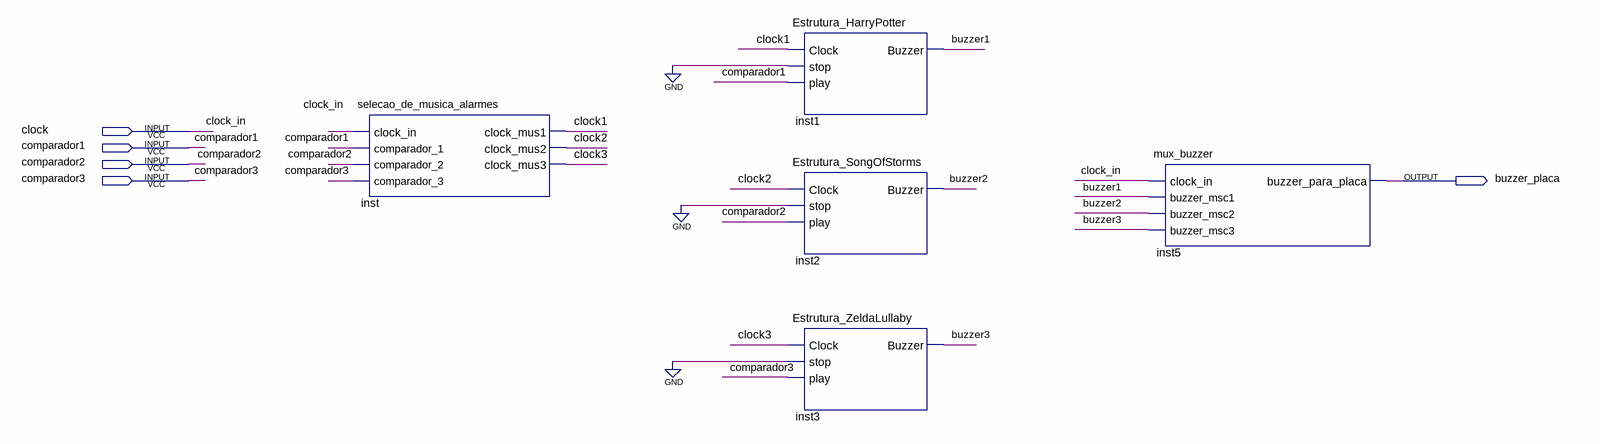
[diagram p0: schematic sheet]
// Quartus schematic Bloco_de_musicas.bdf as structural Verilog: 5 symbols, 5 pins
module Bloco_de_musicas (
  input  clock,
  input  comparador1,
  input  comparador2,
  input  comparador3,
  output buzzer_placa
);

  wire buzzer1, buzzer2, buzzer3, clock1, clock2, clock3;

  selecao_de_musica_alarmes inst (
    .clock_in(clock), .comparador_1(comparador1), .comparador_2(comparador2), .comparador_3(comparador3),
    .clock_mus1(clock1), .clock_mus2(clock2), .clock_mus3(clock3));
  Estrutura_HarryPotter inst1 (.Clock(clock1), .stop(1'b0), .play(comparador1), .Buzzer(buzzer1));
  Estrutura_SongOfStorms inst2 (.Clock(clock2), .stop(1'b0), .play(comparador2), .Buzzer(buzzer2));
  Estrutura_ZeldaLullaby inst3 (.Clock(clock3), .stop(1'b0), .play(comparador3), .Buzzer(buzzer3));
  mux_buzzer inst5 (
    .clock_in(clock), .buzzer_msc1(buzzer1), .buzzer_msc2(buzzer2), .buzzer_msc3(buzzer3),
    .buzzer_para_placa(buzzer_placa));

  // Other names for the same wires on the sheet: clock_in = clock
endmodule
